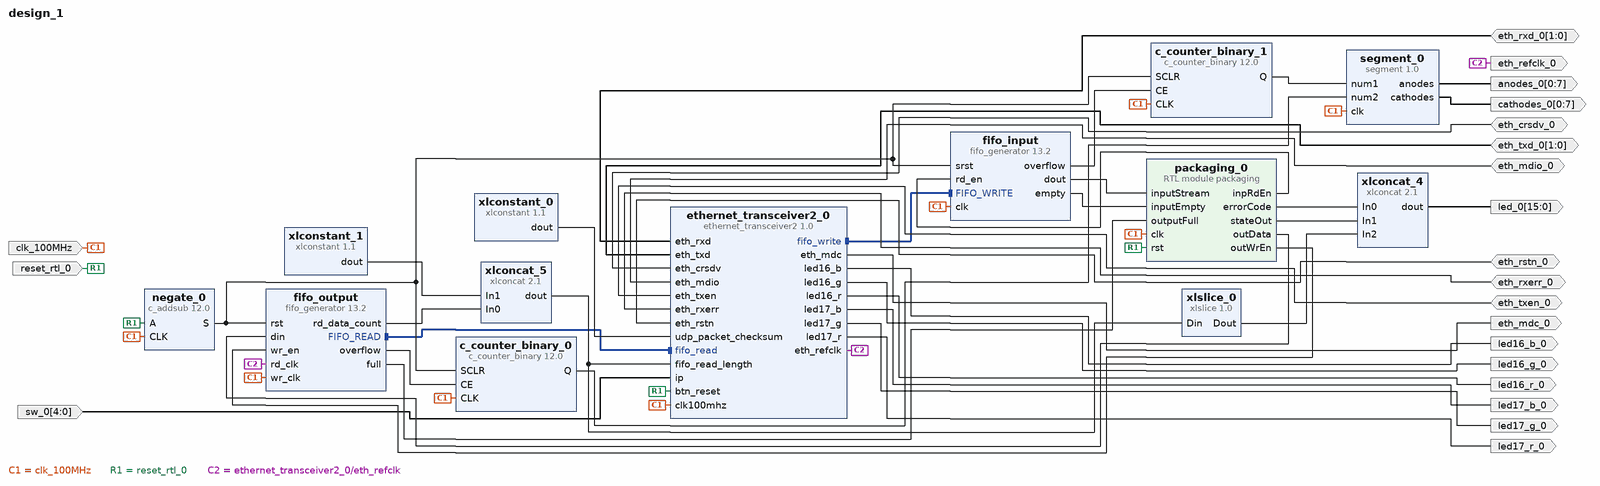
[diagram p0: block diagram of the top level]
# Vivado block design design_1, xc7a100tcsg324-1, Vivado 2018.3
create_bd_design design_1

create_bd_port -dir I -type rst reset_rtl_0
set_property -dict {CONFIG.POLARITY ACTIVE_LOW} [get_bd_ports reset_rtl_0]
create_bd_port -dir I -type clk clk_100MHz
set_property -dict {CONFIG.FREQ_HZ 100000000} [get_bd_ports clk_100MHz]
create_bd_port -dir I -from 4 -to 0 sw_0
create_bd_port -dir O -from 15 -to 0 led_0
create_bd_port -dir O led17_r_0
create_bd_port -dir O led17_g_0
create_bd_port -dir O led17_b_0
create_bd_port -dir O led16_r_0
create_bd_port -dir O led16_g_0
create_bd_port -dir O led16_b_0
create_bd_port -dir O eth_refclk_0
create_bd_port -dir IO eth_mdio_0
create_bd_port -dir O eth_mdc_0
create_bd_port -dir IO eth_rxerr_0
create_bd_port -dir IO eth_txen_0
create_bd_port -dir IO eth_crsdv_0
create_bd_port -dir IO -type rst eth_rstn_0
create_bd_port -dir IO -from 1 -to 0 eth_rxd_0
create_bd_port -dir IO -from 1 -to 0 eth_txd_0
create_bd_port -dir O -from 0 -to 7 anodes_0
create_bd_port -dir O -from 0 -to 7 cathodes_0

create_bd_cell -type ip -vlnv xilinx.com:ip:fifo_generator:13.2 fifo_output
set_property -dict [list \
  CONFIG.Almost_Empty_Flag false \
  CONFIG.Almost_Full_Flag false \
  CONFIG.FIFO_Implementation_rach Common_Clock_Distributed_RAM \
  CONFIG.FIFO_Implementation_wach Common_Clock_Distributed_RAM \
  CONFIG.FIFO_Implementation_wrch Common_Clock_Distributed_RAM \
  CONFIG.Fifo_Implementation Independent_Clocks_Distributed_RAM \
  CONFIG.Full_Flags_Reset_Value 1 \
  CONFIG.INTERFACE_TYPE Native \
  CONFIG.Input_Data_Width 32 \
  CONFIG.Input_Depth 512 \
  CONFIG.Overflow_Flag true \
  CONFIG.Performance_Options Standard_FIFO \
  CONFIG.Programmable_Empty_Type No_Programmable_Empty_Threshold \
  CONFIG.Programmable_Full_Type No_Programmable_Full_Threshold \
  CONFIG.Read_Data_Count true \
  CONFIG.Read_Data_Count_Width 9 \
  CONFIG.Reset_Pin true \
  CONFIG.Underflow_Flag false \
  CONFIG.Use_Dout_Reset true \
  CONFIG.Valid_Flag false \
  CONFIG.Write_Data_Count false \
] [get_bd_cells fifo_output]
create_bd_cell -type ip -vlnv xilinx.com:ip:fifo_generator:13.2 fifo_input
set_property -dict [list \
  CONFIG.Almost_Empty_Flag false \
  CONFIG.Data_Count false \
  CONFIG.FIFO_Implementation_rach Common_Clock_Distributed_RAM \
  CONFIG.FIFO_Implementation_wach Common_Clock_Distributed_RAM \
  CONFIG.FIFO_Implementation_wrch Common_Clock_Distributed_RAM \
  CONFIG.Fifo_Implementation Common_Clock_Distributed_RAM \
  CONFIG.INTERFACE_TYPE Native \
  CONFIG.Input_Data_Width 32 \
  CONFIG.Input_Depth 64 \
  CONFIG.Overflow_Flag true \
  CONFIG.Performance_Options Standard_FIFO \
  CONFIG.Programmable_Empty_Type No_Programmable_Empty_Threshold \
  CONFIG.Programmable_Full_Type No_Programmable_Full_Threshold \
  CONFIG.Reset_Pin true \
  CONFIG.Reset_Type Synchronous_Reset \
  CONFIG.Underflow_Flag false \
  CONFIG.Use_Dout_Reset true \
  CONFIG.Valid_Flag false \
] [get_bd_cells fifo_input]
create_bd_cell -type ip -vlnv xilinx.com:ip:xlconstant:1.1 xlconstant_0
set_property -dict {CONFIG.CONST_VAL 0 CONFIG.CONST_WIDTH 16} [get_bd_cells xlconstant_0]
create_bd_cell -type ip -vlnv xilinx.com:ip:c_counter_binary:12.0 c_counter_binary_0
set_property -dict [list \
  CONFIG.CE true \
  CONFIG.Fb_Latency_Configuration Automatic \
  CONFIG.Final_Count_Value 270F \
  CONFIG.Latency_Configuration Automatic \
  CONFIG.Restrict_Count true \
  CONFIG.SCLR true \
] [get_bd_cells c_counter_binary_0]
create_bd_cell -type ip -vlnv xilinx.com:ip:c_counter_binary:12.0 c_counter_binary_1
set_property -dict [list \
  CONFIG.CE true \
  CONFIG.Fb_Latency_Configuration Automatic \
  CONFIG.Final_Count_Value 270F \
  CONFIG.Latency_Configuration Automatic \
  CONFIG.Restrict_Count true \
  CONFIG.SCLR true \
] [get_bd_cells c_counter_binary_1]
create_bd_cell -type ip -vlnv xilinx.com:ip:xlconcat:2.1 xlconcat_4
set_property -dict [list \
  CONFIG.IN0_WIDTH 4 \
  CONFIG.IN1_WIDTH 4 \
  CONFIG.IN2_WIDTH 8 \
  CONFIG.IN3_WIDTH 2 \
  CONFIG.IN4_WIDTH 5 \
  CONFIG.NUM_PORTS 3 \
] [get_bd_cells xlconcat_4]
create_bd_cell -type ip -vlnv xilinx.com:user:segment:1.0 segment_0
create_bd_cell -type ip -vlnv xilinx.com:ip:c_addsub:12.0 negate_0
set_property -dict [list \
  CONFIG.A_Type Unsigned \
  CONFIG.A_Width 1 \
  CONFIG.Add_Mode Add \
  CONFIG.B_Constant true \
  CONFIG.B_Type Unsigned \
  CONFIG.B_Value 1 \
  CONFIG.B_Width 1 \
  CONFIG.CE false \
  CONFIG.Latency 1 \
  CONFIG.Latency_Configuration Automatic \
  CONFIG.Out_Width 1 \
] [get_bd_cells negate_0]
create_bd_cell -type ip -vlnv xilinx.com:ip:xlconcat:2.1 xlconcat_5
set_property -dict [list \
  CONFIG.IN0_WIDTH 9 \
  CONFIG.IN1_WIDTH 7 \
  CONFIG.IN2_WIDTH 8 \
  CONFIG.IN3_WIDTH 2 \
  CONFIG.IN4_WIDTH 5 \
  CONFIG.NUM_PORTS 2 \
] [get_bd_cells xlconcat_5]
create_bd_cell -type ip -vlnv xilinx.com:ip:xlconstant:1.1 xlconstant_1
set_property -dict {CONFIG.CONST_VAL 0 CONFIG.CONST_WIDTH 7} [get_bd_cells xlconstant_1]
create_bd_cell -type ip -vlnv xilinx.com:ip:xlslice:1.0 xlslice_0
set_property -dict {CONFIG.DIN_FROM 7 CONFIG.DIN_TO 0 CONFIG.DIN_WIDTH 16 CONFIG.DOUT_WIDTH 8} [get_bd_cells xlslice_0]
create_bd_cell -type ip -vlnv xilinx.com:user:ethernet_transceiver2:1.0 ethernet_transceiver2_0
create_bd_cell -type module -reference packaging packaging_0

# ---- connections ----

connect_bd_intf_net [get_bd_intf_pins ethernet_transceiver2_0/fifo_write] [get_bd_intf_pins fifo_input/FIFO_WRITE]
connect_bd_intf_net [get_bd_intf_pins fifo_output/FIFO_READ] [get_bd_intf_pins ethernet_transceiver2_0/fifo_read]
connect_bd_net -net clk_wiz_clk_out1 [get_bd_ports clk_100MHz] \
  [get_bd_pins fifo_input/clk] [get_bd_pins c_counter_binary_0/CLK] [get_bd_pins c_counter_binary_1/CLK] \
  [get_bd_pins segment_0/clk] [get_bd_pins negate_0/CLK] [get_bd_pins fifo_output/wr_clk] \
  [get_bd_pins ethernet_transceiver2_0/clk100mhz] [get_bd_pins packaging_0/clk]
connect_bd_net -net rst_clk_wiz_100M_peripheral_aresetn [get_bd_ports reset_rtl_0] \
  [get_bd_pins negate_0/A] [get_bd_pins ethernet_transceiver2_0/btn_reset] [get_bd_pins packaging_0/rst]
connect_bd_net [get_bd_pins segment_0/anodes] [get_bd_ports anodes_0]
connect_bd_net [get_bd_pins segment_0/cathodes] [get_bd_ports cathodes_0]
connect_bd_net [get_bd_pins xlconstant_0/dout] [get_bd_pins ethernet_transceiver2_0/udp_packet_checksum]
connect_bd_net [get_bd_ports eth_rxd_0] [get_bd_pins ethernet_transceiver2_0/eth_rxd]
connect_bd_net [get_bd_ports eth_txd_0] [get_bd_pins ethernet_transceiver2_0/eth_txd]
connect_bd_net [get_bd_ports eth_crsdv_0] [get_bd_pins ethernet_transceiver2_0/eth_crsdv]
connect_bd_net [get_bd_ports eth_txen_0] [get_bd_pins ethernet_transceiver2_0/eth_txen]
connect_bd_net [get_bd_ports eth_rxerr_0] [get_bd_pins ethernet_transceiver2_0/eth_rxerr]
connect_bd_net [get_bd_pins ethernet_transceiver2_0/eth_mdc] [get_bd_ports eth_mdc_0]
connect_bd_net [get_bd_ports eth_mdio_0] [get_bd_pins ethernet_transceiver2_0/eth_mdio]
connect_bd_net [get_bd_pins ethernet_transceiver2_0/eth_refclk] [get_bd_ports eth_refclk_0] [get_bd_pins fifo_output/rd_clk]
connect_bd_net [get_bd_ports eth_rstn_0] [get_bd_pins ethernet_transceiver2_0/eth_rstn]
connect_bd_net [get_bd_pins ethernet_transceiver2_0/led16_b] [get_bd_ports led16_b_0]
connect_bd_net [get_bd_pins ethernet_transceiver2_0/led16_g] [get_bd_ports led16_g_0]
connect_bd_net [get_bd_pins ethernet_transceiver2_0/led16_r] [get_bd_ports led16_r_0]
connect_bd_net [get_bd_pins ethernet_transceiver2_0/led17_b] [get_bd_ports led17_b_0]
connect_bd_net [get_bd_pins ethernet_transceiver2_0/led17_g] [get_bd_ports led17_g_0]
connect_bd_net [get_bd_pins ethernet_transceiver2_0/led17_r] [get_bd_ports led17_r_0]
connect_bd_net [get_bd_pins c_counter_binary_1/Q] [get_bd_pins segment_0/num1]
connect_bd_net [get_bd_pins xlconcat_4/dout] [get_bd_ports led_0]
connect_bd_net [get_bd_pins c_counter_binary_0/Q] [get_bd_pins segment_0/num2]
connect_bd_net -net xlslice_1_Dout [get_bd_pins negate_0/S] \
  [get_bd_pins c_counter_binary_0/SCLR] [get_bd_pins c_counter_binary_1/SCLR] [get_bd_pins fifo_input/srst] \
  [get_bd_pins fifo_output/rst]
connect_bd_net [get_bd_pins fifo_output/overflow] [get_bd_pins c_counter_binary_0/CE]
connect_bd_net [get_bd_pins fifo_input/overflow] [get_bd_pins c_counter_binary_1/CE]
connect_bd_net [get_bd_pins fifo_output/rd_data_count] [get_bd_pins xlconcat_5/In0]
connect_bd_net [get_bd_pins xlconcat_5/dout] [get_bd_pins xlslice_0/Din] [get_bd_pins ethernet_transceiver2_0/fifo_read_length]
connect_bd_net [get_bd_pins xlconstant_1/dout] [get_bd_pins xlconcat_5/In1]
connect_bd_net [get_bd_pins xlslice_0/Dout] [get_bd_pins xlconcat_4/In2]
connect_bd_net -net sw_0_1 [get_bd_ports sw_0] [get_bd_pins ethernet_transceiver2_0/ip]
connect_bd_net [get_bd_pins packaging_0/inpRdEn] [get_bd_pins fifo_input/rd_en]
connect_bd_net [get_bd_pins fifo_input/dout] [get_bd_pins packaging_0/inputStream]
connect_bd_net [get_bd_pins fifo_input/empty] [get_bd_pins packaging_0/inputEmpty]
connect_bd_net [get_bd_pins fifo_output/full] [get_bd_pins packaging_0/outputFull]
connect_bd_net [get_bd_pins packaging_0/outData] [get_bd_pins fifo_output/din]
connect_bd_net [get_bd_pins packaging_0/outWrEn] [get_bd_pins fifo_output/wr_en]
connect_bd_net [get_bd_pins packaging_0/errorCode] [get_bd_pins xlconcat_4/In0]
connect_bd_net [get_bd_pins packaging_0/stateOut] [get_bd_pins xlconcat_4/In1]

validate_bd_design
save_bd_design
